# Altium project PCB_Project.PrjPcb
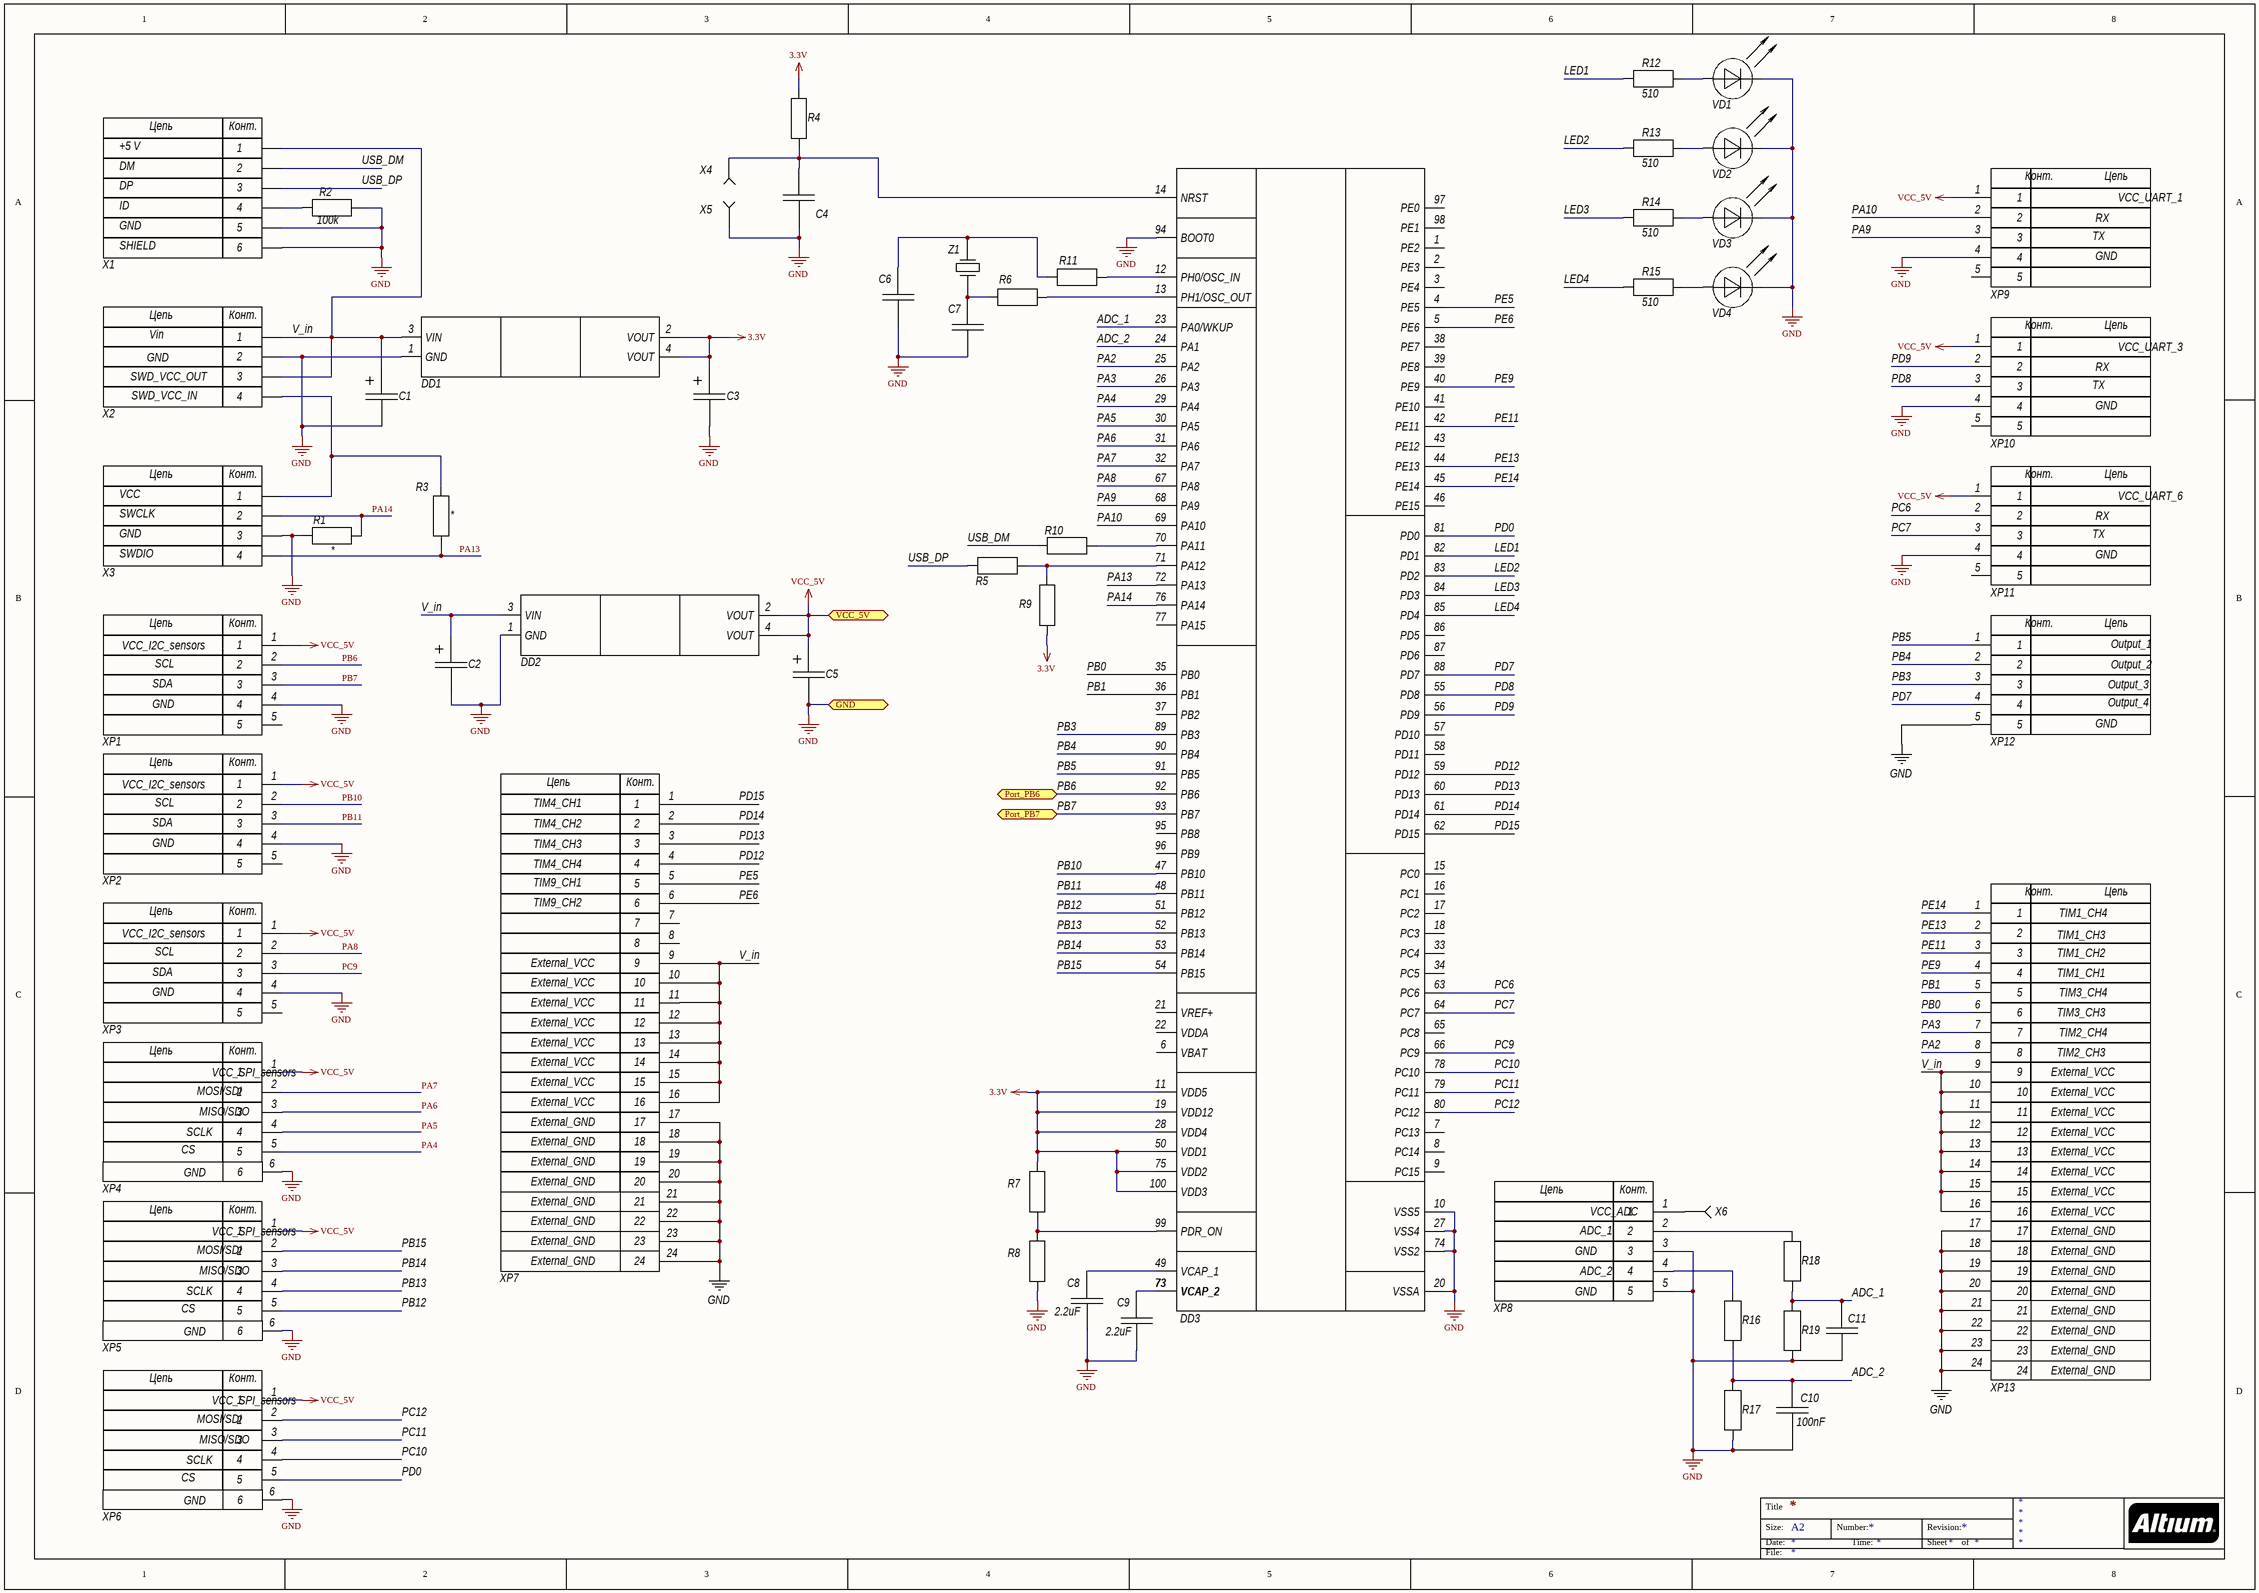
[diagram p0: Tailsitter_sch.SchDoc]
2 sheets, 70 parts. Net scope: flat (ports and power ports of the same name join across sheets).
Board file: Tailsitter_pcb.PcbDoc
Sheets:
  Tailsitter_sch.SchDoc
  Sensors_Board.SchDoc

## Sheet Tailsitter_sch.SchDoc
size A2; PageSetup: Record=PageOptions|CenterHorizontal=False|CenterVertical=False|PrintScale=0.95|XCorrection=0.00|YCorrection=0.00|PrintKind=1|BorderSize=5000000|LeftOffset=0|BottomOffset=0|Orientation=1|PaperLength=1000|PaperWidth=1000|Scale=100|PaperSource=15|PrintQuality=600|MediaType=1|DitherType=10|PaperKind=A4|PrintScaleMode=1

### Parts
C1  Cap El Case A (Tantalum)  [CAP CASE A]  (value not drawn)
C2  Cap El Case A (Tantalum)  [CAP CASE A]  (value not drawn)
C3  Cap El Case A (Tantalum)  [CAP CASE A]  (value not drawn)
C4  Cap EIA 0805  [CAP EIA 0805]  (value not drawn)
C5  Cap El Case A (Tantalum)  [CAP CASE A]  (value not drawn)
C6  Cap EIA 0805  [CAP EIA 0805]  (value not drawn)
C7  Cap EIA 0805  [CAP EIA 0805]  (value not drawn)
C8  value 2.2uF  [CAP EIA 0805]  (hidden comment: Cap EIA 0805)
C9  value 2.2uF  [CAP EIA 0805]  (hidden comment: Cap EIA 0805)
C10  value 100nF  [CAP EIA 0805]  (hidden comment: Cap EIA 0805)
C11  Cap EIA 0805  [CAP EIA 0805]  (value not drawn)
DD1  LM1117S50  [SOT-223_M]  (value not drawn)
DD2  LM1117S50  [SOT-223_M]  (value not drawn)
DD3  STM32F407  [LQFP 14x14-100L]  (value not drawn)
R1  *  [RES EIA 0805]
R2  value 100k  [RES EIA 0805]  (hidden comment: Res EIA 0805)
R3  *  [RES EIA 0805]
R4  Res EIA 0805  [RES EIA 0805]  (value not drawn)
R5  Res EIA 0805  [RES EIA 0805]  (value not drawn)
R6  Res EIA 0805  [RES EIA 0805]  (value not drawn)
R7  Res EIA 0805  [RES EIA 0805]  (value not drawn)
R8  Res EIA 0805  [RES EIA 0805]  (value not drawn)
R9  Res EIA 0805  [RES EIA 0805]  (value not drawn)
R10  Res EIA 0805  [RES EIA 0805]  (value not drawn)
R11  Res EIA 0805  [RES EIA 0805]  (value not drawn)
R12  value 510  [RES EIA 0805]  (hidden comment: Res EIA 0805)
R13  value 510  [RES EIA 0805]  (hidden comment: Res EIA 0805)
R14  value 510  [RES EIA 0805]  (hidden comment: Res EIA 0805)
R15  value 510  [RES EIA 0805]  (hidden comment: Res EIA 0805)
R16  Res EIA 0805  [RES EIA 0805]  (value not drawn)
R17  Res EIA 0805  [RES EIA 0805]  (value not drawn)
R18  Res EIA 0805  [RES EIA 0805]  (value not drawn)
R19  Res EIA 0805  [RES EIA 0805]  (value not drawn)
VD1  KP-2012xxxx  [SMD LED 0805 (GREEN)]  (value not drawn)
VD2  KP-2012xxxx  [SMD LED 0805 (GREEN)]  (value not drawn)
VD3  KP-2012xxxx  [SMD LED 0805 (GREEN)]  (value not drawn)
VD4  KP-2012xxxx  [SMD LED 0805 (GREEN)]  (value not drawn)
X1  USB/M-1J  [USB/M-1J (DS1104)]  (value not drawn)
X2  (no value)  [SWD]
X3  (no value)  [SWD]
X4  Pin_Referal  [Pin - Referal]  (value not drawn)  (no BOM)
X5  Pin_Referal  [Pin - Referal]  (value not drawn)  (no BOM)
X6  Pin_Referal  [Pin - Referal]  (value not drawn)  (no BOM)
XP1  BM05B-SRSS-TB  [BM05B-SRSS-TB]  (value not drawn)
XP2  BM05B-SRSS-TB  [BM05B-SRSS-TB]  (value not drawn)
XP3  BM05B-SRSS-TB  [BM05B-SRSS-TB]  (value not drawn)
XP4  Micro JST 6 pin  [Micro JST-6 pin]  (value not drawn)
XP5  Micro JST 6 pin  [Micro JST-6 pin]  (value not drawn)
XP6  Micro JST 6 pin  [Micro JST-6 pin]  (value not drawn)
XP7  PLD-24-3  [PLD-24-3]  (value not drawn)
XP8  BM05B-SRSS-TB  [BM05B-SRSS-TB]  (value not drawn)
XP9  BM05B-SRSS-TB  [BM05B-SRSS-TB]  (value not drawn)
XP10  BM05B-SRSS-TB  [BM05B-SRSS-TB]  (value not drawn)
XP11  BM05B-SRSS-TB  [BM05B-SRSS-TB]  (value not drawn)
XP12  BM05B-SRSS-TB  [BM05B-SRSS-TB]  (value not drawn)
XP13  PLD-24-3  [PLD-24-3]  (value not drawn)
Z1  ABM3-8.000MHZ-D2Y-T  [bq smd 5x3.2]  (value not drawn)

### Ports
GND, Port_PB6, Port_PB7, VCC_5V

### Nets
3.3V: C3.1 DD1.2(VOUT) DD1.4(VOUT) DD3.11(VDD5) DD3.19(VDD12) DD3.28(VDD4) DD3.50(VDD1) DD3.75(VDD2) DD3.100(VDD3) R4.2 R7.2 R9.1
GND: C1.2 C2.2 C3.2 C4.1 C5.2 C6.2 C7.2 C8.1 C9.1 C10.2 C11.2 DD1.1(GND) DD2.1(GND) DD3.10(VSS5) DD3.20(VSSA) DD3.27(VSS4) DD3.74(VSS2) DD3.94(BOOT0) R1.2 R2.2 R8.2 R17.1 R19.1 VD1.2(K) VD2.2(K) VD3.2(K) VD4.2(K) X1.5(GND) X2.2 X3.3(GND) X5.1 XP1.4 XP2.4 XP3.4 XP4.6 XP5.6 XP6.6 XP7.17 XP7.18 XP7.19 XP7.20 XP7.21 XP7.22 XP7.23 XP7.24 XP8.3 XP8.5 XP9.4 XP10.4 XP11.4 XP12.5 XP13.17 XP13.18 XP13.19 XP13.20 XP13.21 XP13.22 XP13.23 XP13.24 ; port GND
VCC_5V: C5.1 DD2.2(VOUT) DD2.4(VOUT) XP1.1 XP2.1 XP3.1 XP4.1 XP5.1 XP6.1 XP9.1 XP10.1 XP11.1 ; port VCC_5V
ADC_1: C11.1 DD3.23(PA0/WKUP) R18.1 R19.2
ADC_2: C10.1 DD3.24(PA1) R16.1 R17.2
LED1: DD3.82(PD1) R12.1
LED2: DD3.83(PD2) R13.1
LED3: DD3.84(PD3) R14.1
LED4: DD3.85(PD4) R15.1
PA2: DD3.25(PA2) XP13.8
PA3: DD3.26(PA3) XP13.7
PA4: DD3.29(PA4) XP4.5
PA5: DD3.30(PA5) XP4.4
PA6: DD3.31(PA6) XP4.3
PA7: DD3.32(PA7) XP4.2
PA8: DD3.67(PA8) XP3.2
PA9: DD3.68(PA9) XP9.3
PA10: DD3.69(PA10) XP9.2
PA13: DD3.72(PA13) R3.2 X3.4(SWDIO)
PA14: DD3.76(PA14) R1.1 X3.2(SWCLK)
PB0: DD3.35(PB0) XP13.6
PB1: DD3.36(PB1) XP13.5
PB3: DD3.89(PB3) XP12.3
PB4: DD3.90(PB4) XP12.2
PB5: DD3.91(PB5) XP12.1
PB6: DD3.92(PB6) XP1.2 ; port Port_PB6
PB7: DD3.93(PB7) XP1.3 ; port Port_PB7
PB10: DD3.47(PB10) XP2.2
PB11: DD3.48(PB11) XP2.3
PB12: DD3.51(PB12) XP5.5
PB13: DD3.52(PB13) XP5.4
PB14: DD3.53(PB14) XP5.3
PB15: DD3.54(PB15) XP5.2
PC6: DD3.63(PC6) XP11.2
PC7: DD3.64(PC7) XP11.3
PC9: DD3.66(PC9) XP3.3
PC10: DD3.78(PC10) XP6.4
PC11: DD3.79(PC11) XP6.3
PC12: DD3.80(PC12) XP6.2
PD0: DD3.81(PD0) XP6.5
PD7: DD3.88(PD7) XP12.4
PD8: DD3.55(PD8) XP10.3
PD9: DD3.56(PD9) XP10.2
PD12: DD3.59(PD12) XP7.4
PD13: DD3.60(PD13) XP7.3
PD14: DD3.61(PD14) XP7.2
PD15: DD3.62(PD15) XP7.1
PE5: DD3.4(PE5) XP7.5
PE6: DD3.5(PE6) XP7.6
PE9: DD3.40(PE9) XP13.4
PE11: DD3.42(PE11) XP13.3
PE13: DD3.44(PE13) XP13.2
PE14: DD3.45(PE14) XP13.1
USB_DM: R10.1 X1.2(DM)
USB_DP: R5.1 X1.3(DP)
V_in: C1.1 C2.1 DD1.3(VIN) DD2.3(VIN) X1.1(+5_V) X2.1 X2.3 XP7.9 XP7.10 XP7.11 XP7.12 XP7.13 XP7.14 XP7.15 XP7.16 XP13.9 XP13.10 XP13.11 XP13.12 XP13.13 XP13.14 XP13.15 XP13.16
NetC4_2: C4.2 DD3.14(NRST) R4.1 X4.1
NetC6_1: C6.1 R11.1 Z1.1
NetC7_1: C7.1 R6.1 Z1.2
NetC8_2: C8.2 DD3.49(VCAP_1)
NetC9_2: C9.2 DD3.73(VCAP_2)
NetDD3_12: DD3.12(PH0/OSC_IN) R11.2
NetDD3_13: DD3.13(PH1/OSC_OUT) R6.2
NetDD3_70: DD3.70(PA11) R10.2
NetDD3_71: DD3.71(PA12) R5.2 R9.2
NetDD3_99: DD3.99(PDR_ON) R7.1 R8.1
NetR2_1: R2.1 X1.4(ID)
NetR3_1: R3.1 X2.4 X3.1(VCC)
NetR12_2: R12.2 VD1.1(A)
NetR13_2: R13.2 VD2.1(A)
NetR14_2: R14.2 VD3.1(A)
NetR15_2: R15.2 VD4.1(A)
NetR16_2: R16.2 XP8.4
NetR18_2: R18.2 XP8.2
NetX6_1: X6.1 XP8.1

Not connected (* = marked no-connect by the designer): DD3 1(PE2) 2(PE3) 3(PE4) 6(VBAT) 7(PC13) 8(PC14) 9(PC15) 15(PC0) 16(PC1) 17(PC2) 18(PC3) 21(VREF+) 22(VDDA) 33(PC4) 34(PC5) 37(PB2) 38(PE7) 39(PE8) 41(PE10) 43(PE12) 46(PE15) 57(PD10) 58(PD11) 65(PC8) 77(PA15) 86(PD5) 87(PD6) 95(PB8) 96(PB9) 97(PE0) 98(PE1); XP1 5; XP2 5; XP3 5; XP7 7 8; XP9 5; XP10 5; XP11 5

### Notes on the sheet
- TX
- RX
- VCC_UART_1
- GND
- Vin
- SWD_VCC_OUT
- VCC_UART_3
- SWD_VCC_IN
- VCC_UART_6
- VCC_I2C_sensors
- Output_1
- SDA
- SCL
- Output_3
- Output_2
- Output_4
- TIM4_CH1
- TIM4_CH2
- TIM4_CH3
- TIM4_CH4
- TIM9_CH1
- TIM9_CH2
- TIM1_CH3
- TIM1_CH4
- External_VCC
- TIM1_CH2
- TIM1_CH1
- TIM3_CH4
- TIM3_CH3
- TIM2_CH4
- MOSI/SDI
- VCC_SPI_sensors
- TIM2_CH3
- CS
- SCLK
- MISO/SDO
- External_GND
- ADC_1
- VCC_ADC
- ADC_2
- Title
- Size:
- Date:
- File:
- A2
- Number:
- Time:
- Revision:
- Sheet
- of
- (in symbol BM05B-SRSS-TB) Цепь; Конт.
- (in symbol Micro JST-6 pin) Цепь; Конт.
- (in symbol PLD-24-3) Конт.; Цепь
- (in symbol PLS-4) Цепь; Конт.
- (in symbol SWD(PLS- 4)) Цепь; Конт.
- (in symbol USB/M-1J) Цепь; Конт.; SHIELD; 6

### Library data of the parts
C1-C3 C5 = Cap El Case A (Tantalum): Group: Конденсаторы; Manufacturer: *; Name: *; Value: *; Supplier: *
C4 C6-C11 = Cap EIA 0805: Group: Конденсаторы; Manufacturer: *; Name: *; Supplier: *
  C4 C6 C7 C11: Value: *
DD1 DD2 = LM1117S50: LDO Voltage Regulator; Manufacturer: ST Microelectronics; Group: Микросхемы; Value: Регулятор напряжения LDO 800mA; Name: LM1117S50; Supplier: ООО "Торгэлектроника"
DD3 = STM32F407: ARM Cortex-M4 MCU with 1 Mbytes Flash, 168 MHz CPU; Manufacturer: ST; Name: STM32F407VG; Group: Микросхемы; Value: Микроконтроллер; Supplier: ООО"Торгэлектроника"
R1-R19 = Res EIA 0805: Group: Резисторы; Manufacturer: *; Name: *; Supplier: *
  R1 R3-R11 R16-R19: Value: *
VD1-VD4 = FYLS-0805xxxx: SMD Led; Manufacture: Foryard (FORYARD); Group: Диоды; Value: Светодиод общего назначения - Цвет: Красный; N: 1; λ1:  645 нм; Iv1: 80 мкд; U: 2.6 В;; Name: KP-2012xxxx; Supplier: ООО "Компэл"
X1 = USB/M-1J: Mini USB Receptacle; Manufacturer: Connfly; Group: Разъемы; Value: Разъем miniUSB (м) на плату; Name: USB/M-1J (DS1104); Supplier: ООО"Торгэлектроника"
X2 = PLS-4: Manufacturer: Hsuan Mao(Китай); Group: Разъемы; Value: Разъем штыревой четырехконтактный; Name: PLS-4; Supplier: ООО"Торгэлектроника"
X3 = SWD(PLS- 4): Manufacturer: Тайвань(Китай); Name: PLS- 4; Group: Разъемы; Value: Вилка штыревая 2.54мм 1x4 прям; Supplier: ООО"Торгэлектроника"
X4-X6 = Pin_Referal: Generic Pin Contact; Value: Generic Pin Contact Referal; Group: -; Manufacturer: -; Name: -; Supplier: -
XP1-XP3 XP8-XP12 = BM05B-SRSS-TB: 5-Pin Angle Connector; Manufacturer: JST; Group: Разъемы; Value: Разъем штыревой 5-и контактный угловой; Name: BM05B-SRSS-TB; Supplier: ООО"Компэл"
XP4-XP6 = Micro JST-6 pin: Group: Разъемы; Производитель: JST
XP7 XP13 = PLD-24-3: Разъем для подключение RC-приемника или регуляторов хода
Z1 = ABM3-8.000MHZ-D2Y-T: Manufacturer: ABRACON; Group: Кварцевые резонаторы; Value: 8 МГц; PPM25°C: 20 ppm; PPMТраб: 30 ppm; Монтаж: SMD; CНагр: 18 пФ; Name: ABM3-8.000MHZ-D2Y-T; Supplier: ООО"Торгэлектроника"

## Sheet Sensors_Board.SchDoc
size A4
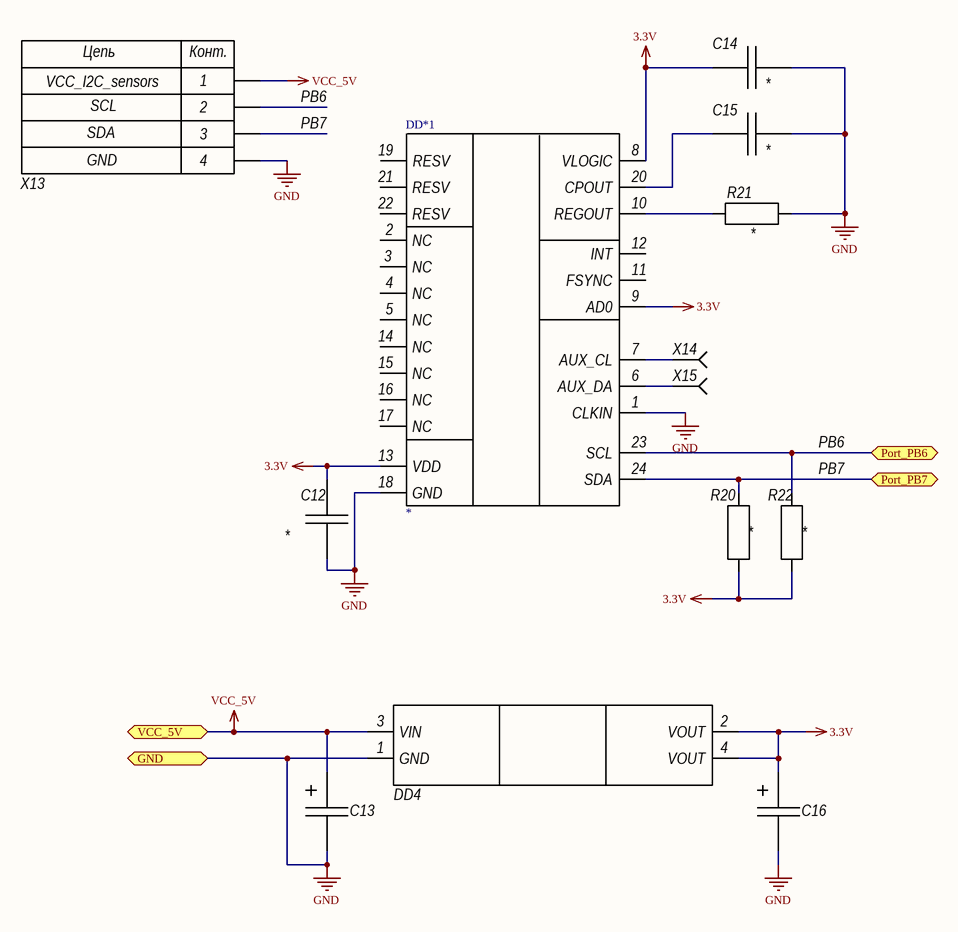
[diagram p1: Sensors_Board.SchDoc]

### Parts
C12  *  [CAP EIA 0805]
C13  Cap El Case A (Tantalum)  [CAP CASE A]  (value not drawn)
C14  *  [CAP EIA 0805]
C15  *  [CAP EIA 0805]
C16  Cap El Case A (Tantalum)  [CAP CASE A]  (value not drawn)
DD4  LM1117S50  [SOT-223_M]  (value not drawn)
DD*1  *  [(MPU60-x0)QNF24 4*4*0.9]
R20  *  [RES EIA 0805]
R21  *  [RES EIA 0805]
R22  *  [RES EIA 0805]
X13  (no value)  [SWD]
X14  *  [Pin - Referal]  (value not drawn)  (no BOM)
X15  *  [Pin - Referal]  (value not drawn)  (no BOM)

### Ports
GND, Port_PB6, Port_PB7, VCC_5V

### Nets
3.3V: C12.1 C14.1 C16.1 DD4.2(VOUT) DD4.4(VOUT) DD*1.8(VLOGIC) DD*1.9(AD0) DD*1.13(VDD) R20.2 R22.1
GND: C12.2 C13.2 C14.2 C15.2 C16.2 DD4.1(GND) DD*1.1(CLKIN) DD*1.18(GND) R21.1 X13.4 ; port GND
VCC_5V: C13.1 DD4.3(VIN) X13.1 ; port VCC_5V
PB6: DD*1.23(SCL) R22.2 X13.2 ; port Port_PB6
PB7: DD*1.24(SDA) R20.1 X13.3 ; port Port_PB7
NetC15_1: C15.1 DD*1.20(CPOUT)
NetDD*1_6: DD*1.6(AUX_DA) X15.1
NetDD*1_7: DD*1.7(AUX_CL) X14.1
NetDD*1_10: DD*1.10(REGOUT) R21.2

Not connected (* = marked no-connect by the designer): DD*1 2(NC) 3(NC) 4(NC) 5(NC) 11(FSYNC) 12(INT) 14(NC) 15(NC) 16(NC) 17(NC) 19(RESV) 21(RESV) 22(RESV)

### Notes on the sheet
- VCC_I2C_sensors
- SDA
- SCL
- GND
- (in symbol PLS-4) Цепь; Конт.

### Library data of the parts
C12 C14 C15 = Cap EIA 0805: Group: Конденсаторы; Manufacturer: *; Name: *; Value: *; Supplier: *
C13 C16 = Cap El Case A (Tantalum): Group: Конденсаторы; Manufacturer: *; Name: *; Value: *; Supplier: *
DD4 = LM1117S50: as DD1 on sheet Tailsitter_sch; Name: LM1117S50; Supplier: ООО "Торгэлектроника"
DD*1 = MPU6050: MPU-60X0 is the device that combines a 3-axis  gyroscope, 3-axis accelerometer
R20-R22 = Res EIA 0805: Group: Резисторы; Manufacturer: *; Name: *; Value: *; Supplier: *
X13 = PLS-4: as X2 on sheet Tailsitter_sch; Name: PLS-4; Supplier: ООО"Торгэлектроника"
X14 X15 = Pin_Referal: as X4 on sheet Tailsitter_sch; Group: -; Manufacturer: -; Name: -; Supplier: -

## Nets that join several sheets
3.3V: Tailsitter_sch (12 pins), Sensors_Board (10 pins)
GND: Tailsitter_sch (59 pins), Sensors_Board (10 pins)
VCC_5V: Tailsitter_sch (12 pins), Sensors_Board (C13.1 DD4.3 X13.1)
PB6: Tailsitter_sch (DD3.92 XP1.2), Sensors_Board (DD*1.23 R22.2 X13.2)
PB7: Tailsitter_sch (DD3.93 XP1.3), Sensors_Board (DD*1.24 R20.1 X13.3)